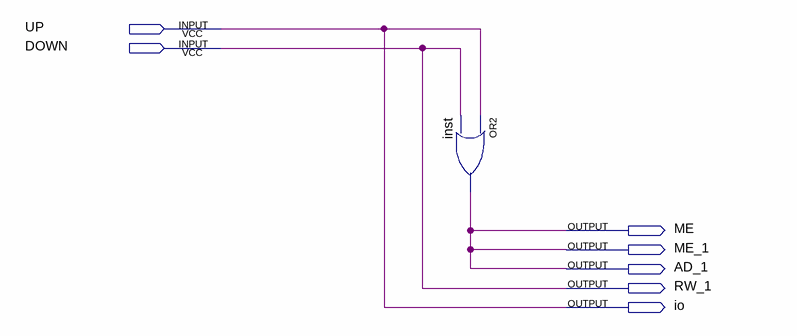
[diagram p0: schematic sheet]
// Quartus schematic CONTRL.bdf as structural Verilog: 1 symbols, 7 pins
module CONTRL (
  input  UP,
  input  DOWN,
  output ME,
  output ME_1,
  output AD_1,
  output RW_1,
  output io
);

  or inst (AD_1, UP, DOWN);

  assign io = UP;
  assign ME = AD_1;
  assign ME_1 = AD_1;
  assign RW_1 = DOWN;
endmodule
